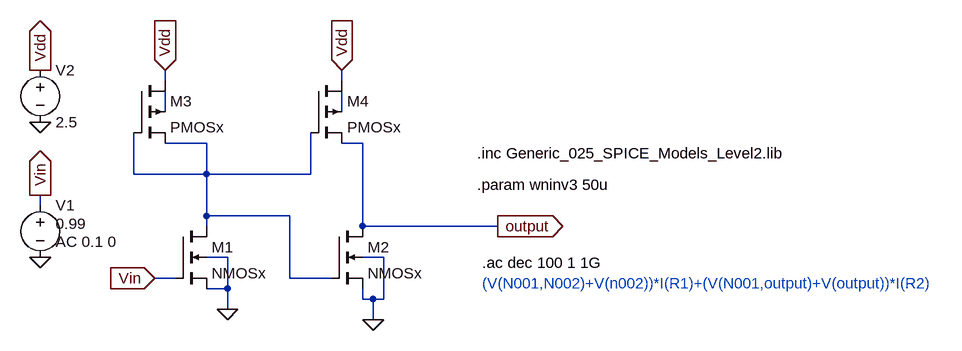
[diagram p0: schematic P2C2.asc]
P2C2.asc, the LTspice schematic file:
Version 4
SHEET 1 1440 680
WIRE 144 48 144 32
WIRE 416 48 416 32
WIRE 144 96 144 64
WIRE 416 96 416 64
WIRE 208 144 144 144
WIRE 448 144 416 144
WIRE 96 192 96 128
WIRE 208 192 208 144
WIRE 208 192 96 192
WIRE 368 192 368 128
WIRE 368 192 208 192
WIRE -48 240 -48 224
WIRE 208 256 208 192
WIRE 336 256 208 256
WIRE 208 272 208 256
WIRE 448 272 448 144
WIRE 656 272 448 272
WIRE 240 320 208 320
WIRE 480 320 448 320
WIRE 160 352 128 352
WIRE 336 352 336 256
WIRE 400 352 336 352
WIRE 240 368 240 320
WIRE 240 368 208 368
WIRE 448 384 448 368
WIRE 464 384 448 384
WIRE 480 384 480 320
WIRE 480 384 464 384
WIRE 240 400 240 368
WIRE 464 416 464 384
FLAG -48 112 0
FLAG -48 320 0
FLAG 240 400 0
FLAG 464 416 0
FLAG 656 272 output
IOPIN 656 272 Out
FLAG -48 32 Vdd
IOPIN -48 32 Out
FLAG -48 224 Vin
IOPIN -48 224 Out
FLAG 144 32 Vdd
IOPIN 144 32 In
FLAG 128 352 Vin
IOPIN 128 352 In
FLAG 416 32 Vdd
IOPIN 416 32 In
SYMBOL nmos4 160 272 R0
SYMATTR InstName M1
SYMATTR Value NMOSx
SYMATTR Value2 l=2.5u w=wninv3
SYMBOL voltage -48 224 R0
WINDOW 3 24 44 Left 2
WINDOW 123 24 72 Left 2
WINDOW 39 0 0 Left 2
SYMATTR Value 0.99
SYMATTR Value2 AC 0.1 0
SYMATTR InstName V1
SYMBOL voltage -48 16 R0
WINDOW 123 0 0 Left 2
WINDOW 39 0 0 Left 2
SYMATTR InstName V2
SYMATTR Value 2.5
SYMBOL nmos4 400 272 R0
SYMATTR InstName M2
SYMATTR Value NMOSx
SYMATTR Value2 l=2.5u w=wninv3
SYMBOL pmos4 96 48 R0
SYMATTR InstName M3
SYMATTR Value PMOSx
SYMATTR Value2 l=2.5u w=wninv3
SYMBOL pmos4 368 48 R0
SYMATTR InstName M4
SYMATTR Value PMOSx
SYMATTR Value2 l=2.5u w=wninv3
TEXT 624 160 Left 2 !.inc Generic_025_SPICE_Models_Level2.lib
TEXT 624 208 Left 2 !.param wninv3 50u
TEXT 632 328 Left 2 !.ac dec 100 1 1G
TEXT 632 360 Left 2 ;(V(N001,N002)+V(n002))*I(R1)+(V(N001,output)+V(output))*I(R2)

The netlist it stands for:
* P2C2.asc
M1 N003 Vin 0 0 NMOSx l=2.5u w=wninv3
V1 Vin 0 0.99 AC 0.1 0
V2 Vdd 0 2.5
M2 output N003 0 0 NMOSx l=2.5u w=wninv3
M3 Vdd N003 N003 N001 PMOSx l=2.5u w=wninv3
M4 Vdd N003 output N002 PMOSx l=2.5u w=wninv3
.model NMOS NMOS
.model PMOS PMOS
.lib standard.mos
.inc Generic_025_SPICE_Models_Level2.lib
.param wninv3 50u
.ac dec 100 1 1G
* (V(N001,N002)+V(n002))*I(R1)+(V(N001,output)+V(output))*I(R2)
.backanno
.end